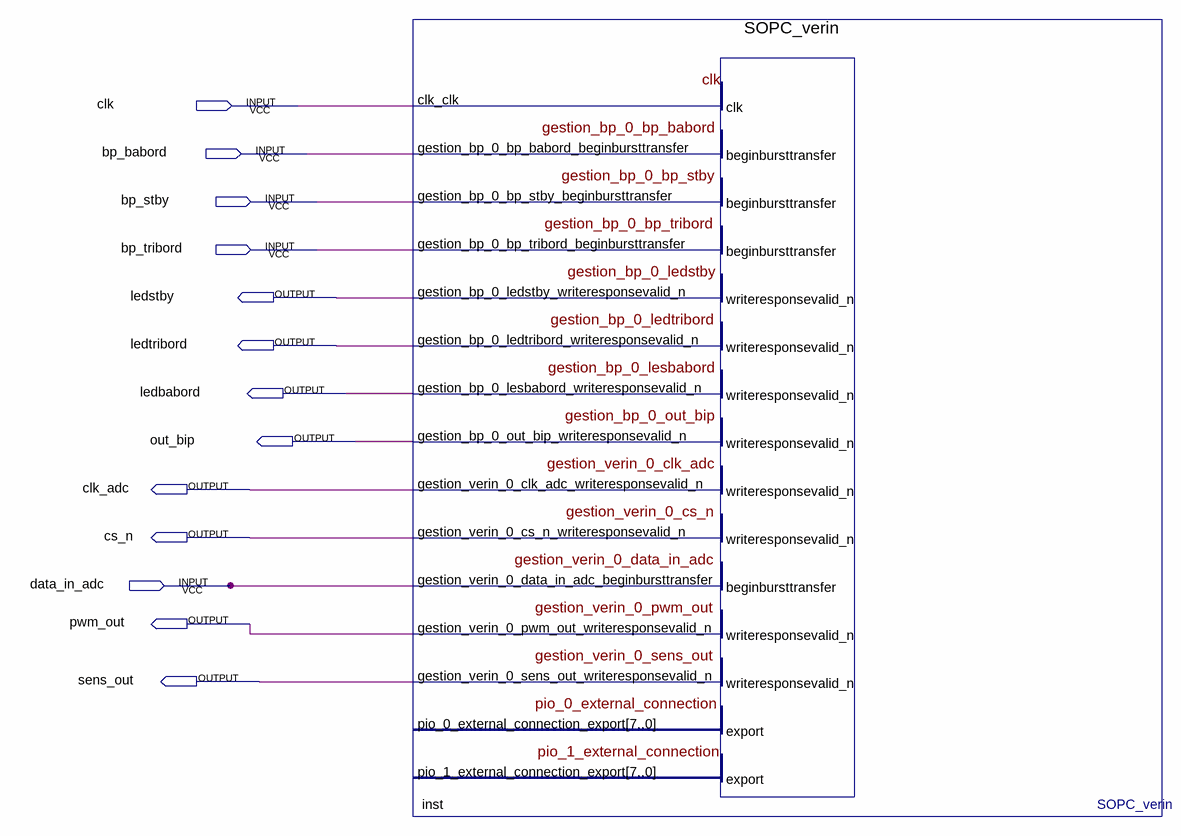
[diagram p0: schematic sheet]
// Quartus schematic bloc_gestion_verin.bdf as structural Verilog: 1 symbols, 13 pins
module bloc_gestion_verin (
  input  clk,
  input  bp_babord,
  input  bp_stby,
  input  bp_tribord,
  input  data_in_adc,
  output ledstby,
  output ledtribord,
  output ledbabord,
  output out_bip,
  output clk_adc,
  output cs_n,
  output pwm_out,
  output sens_out
);

  SOPC_verin inst (
    .clk_clk(clk), .gestion_bp_0_bp_babord_beginbursttransfer(bp_babord),
    .gestion_bp_0_bp_stby_beginbursttransfer(bp_stby),
    .gestion_bp_0_bp_tribord_beginbursttransfer(bp_tribord),
    .gestion_verin_0_data_in_adc_beginbursttransfer(data_in_adc),
    .gestion_bp_0_ledstby_writeresponsevalid_n(ledstby),
    .gestion_bp_0_ledtribord_writeresponsevalid_n(ledtribord),
    .gestion_bp_0_lesbabord_writeresponsevalid_n(ledbabord),
    .gestion_bp_0_out_bip_writeresponsevalid_n(out_bip),
    .gestion_verin_0_clk_adc_writeresponsevalid_n(clk_adc), .gestion_verin_0_cs_n_writeresponsevalid_n(cs_n),
    .gestion_verin_0_pwm_out_writeresponsevalid_n(pwm_out),
    .gestion_verin_0_sens_out_writeresponsevalid_n(sens_out));  // open: pio_0_external_connection_export, pio_1_external_connection_export
endmodule
